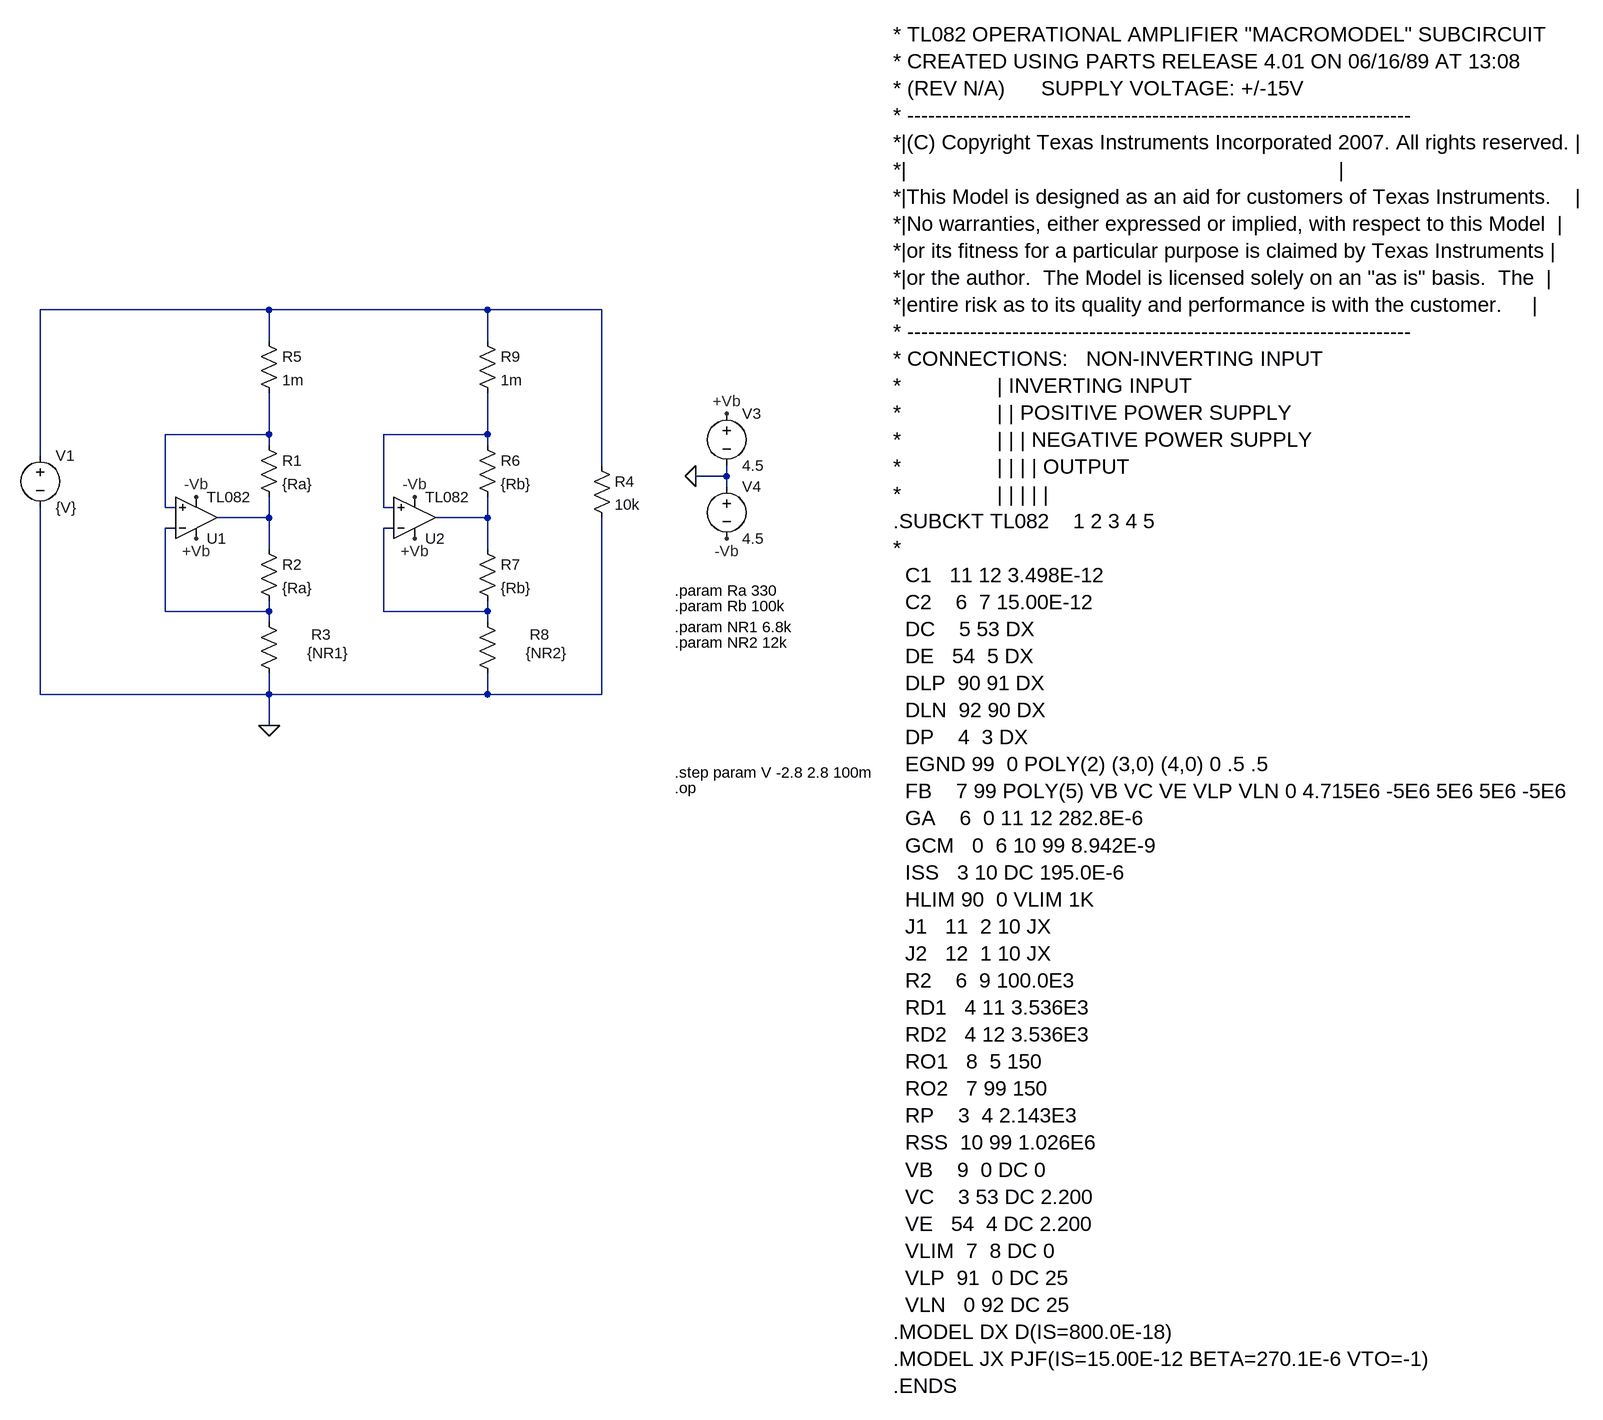
[diagram p0: schematic negres.asc]
negres.asc, the LTspice schematic file:
Version 4
SHEET 1 1280 2032
WIRE -1504 -368 -1856 -368
WIRE -1168 -368 -1504 -368
WIRE -992 -368 -1168 -368
WIRE -1504 -320 -1504 -368
WIRE -1168 -320 -1168 -368
WIRE -1504 -176 -1504 -240
WIRE -1504 -176 -1664 -176
WIRE -1168 -176 -1168 -240
WIRE -1168 -176 -1328 -176
WIRE -1504 -160 -1504 -176
WIRE -1168 -160 -1168 -176
WIRE -1856 -144 -1856 -368
WIRE -992 -128 -992 -368
WIRE -800 -112 -800 -128
WIRE -800 -112 -848 -112
WIRE -800 -96 -800 -112
WIRE -1664 -64 -1664 -176
WIRE -1648 -64 -1664 -64
WIRE -1328 -64 -1328 -176
WIRE -1312 -64 -1328 -64
WIRE -1504 -48 -1504 -80
WIRE -1504 -48 -1584 -48
WIRE -1168 -48 -1168 -80
WIRE -1168 -48 -1248 -48
WIRE -1648 -32 -1664 -32
WIRE -1312 -32 -1328 -32
WIRE -1504 0 -1504 -48
WIRE -1168 0 -1168 -48
WIRE -1664 96 -1664 -32
WIRE -1504 96 -1504 80
WIRE -1504 96 -1664 96
WIRE -1328 96 -1328 -32
WIRE -1168 96 -1168 80
WIRE -1168 96 -1328 96
WIRE -1504 112 -1504 96
WIRE -1168 112 -1168 96
WIRE -1856 224 -1856 -64
WIRE -1504 224 -1504 192
WIRE -1504 224 -1856 224
WIRE -1168 224 -1168 192
WIRE -1168 224 -1504 224
WIRE -992 224 -992 -48
WIRE -992 224 -1168 224
WIRE -1504 272 -1504 224
FLAG -800 -16 -Vb
FLAG -800 -208 +Vb
FLAG -848 -112 0
FLAG -1616 -80 -Vb
FLAG -1616 -16 +Vb
FLAG -1504 272 0
FLAG -1280 -80 -Vb
FLAG -1280 -16 +Vb
SYMBOL voltage -800 -224 R0
WINDOW 123 0 0 Left 2
WINDOW 39 24 124 Left 2
SYMATTR InstName V3
SYMATTR Value 4.5
SYMBOL voltage -800 -112 R0
WINDOW 123 0 0 Left 2
WINDOW 39 24 124 Left 2
SYMATTR InstName V4
SYMATTR Value 4.5
SYMBOL Opamps\\opamp2 -1616 16 M180
SYMATTR InstName U1
SYMATTR Value TL082
SYMBOL res -1520 -176 R0
SYMATTR InstName R1
SYMATTR Value {Ra}
SYMATTR SpiceLine tol=5 pwr=1
SYMBOL res -1520 -16 R0
SYMATTR InstName R2
SYMATTR Value {Ra}
SYMATTR SpiceLine tol=5 pwr=1
SYMBOL res -1520 96 R0
WINDOW 0 81 36 Left 2
WINDOW 3 75 64 Left 2
SYMATTR InstName R3
SYMATTR Value {NR1}
SYMATTR SpiceLine tol=5 pwr=1
SYMBOL voltage -1856 -160 R0
WINDOW 123 0 0 Left 2
WINDOW 39 24 124 Left 2
SYMATTR InstName V1
SYMATTR Value {V}
SYMBOL res -1008 -144 R0
SYMATTR InstName R4
SYMATTR Value 10k
SYMBOL res -1520 -336 R0
SYMATTR InstName R5
SYMATTR Value 1m
SYMBOL Opamps\\opamp2 -1280 16 M180
SYMATTR InstName U2
SYMATTR Value TL082
SYMBOL res -1184 -176 R0
SYMATTR InstName R6
SYMATTR Value {Rb}
SYMATTR SpiceLine tol=5 pwr=1
SYMBOL res -1184 -16 R0
SYMATTR InstName R7
SYMATTR Value {Rb}
SYMATTR SpiceLine tol=5 pwr=1
SYMBOL res -1184 96 R0
WINDOW 0 81 36 Left 2
WINDOW 3 75 64 Left 2
SYMATTR InstName R8
SYMATTR Value {NR2}
SYMATTR SpiceLine tol=5 pwr=1
SYMBOL res -1184 -336 R0
SYMATTR InstName R9
SYMATTR Value 1m
TEXT -544 -792 Left 3 !* TL082 OPERATIONAL AMPLIFIER "MACROMODEL" SUBCIRCUIT\n* CREATED USING PARTS RELEASE 4.01 ON 06/16/89 AT 13:08\n* (REV N/A)      SUPPLY VOLTAGE: +/-15V\n* ------------------------------------------------------------------------\n*|(C) Copyright Texas Instruments Incorporated 2007. All rights reserved. |\n*|                                                                        |\n*|This Model is designed as an aid for customers of Texas Instruments.    |\n*|No warranties, either expressed or implied, with respect to this Model  |\n*|or its fitness for a particular purpose is claimed by Texas Instruments |\n*|or the author.  The Model is licensed solely on an "as is" basis.  The  |\n*|entire risk as to its quality and performance is with the customer.     |\n* ------------------------------------------------------------------------\n* CONNECTIONS:   NON-INVERTING INPUT\n*                | INVERTING INPUT\n*                | | POSITIVE POWER SUPPLY\n*                | | | NEGATIVE POWER SUPPLY\n*                | | | | OUTPUT\n*                | | | | |\n.SUBCKT TL082    1 2 3 4 5\n*\n  C1   11 12 3.498E-12\n  C2    6  7 15.00E-12\n  DC    5 53 DX\n  DE   54  5 DX\n  DLP  90 91 DX\n  DLN  92 90 DX\n  DP    4  3 DX\n  EGND 99  0 POLY(2) (3,0) (4,0) 0 .5 .5\n  FB    7 99 POLY(5) VB VC VE VLP VLN 0 4.715E6 -5E6 5E6 5E6 -5E6\n  GA    6  0 11 12 282.8E-6\n  GCM   0  6 10 99 8.942E-9\n  ISS   3 10 DC 195.0E-6\n  HLIM 90  0 VLIM 1K\n  J1   11  2 10 JX\n  J2   12  1 10 JX\n  R2    6  9 100.0E3\n  RD1   4 11 3.536E3\n  RD2   4 12 3.536E3\n  RO1   8  5 150\n  RO2   7 99 150\n  RP    3  4 2.143E3\n  RSS  10 99 1.026E6\n  VB    9  0 DC 0\n  VC    3 53 DC 2.200\n  VE   54  4 DC 2.200\n  VLIM  7  8 DC 0\n  VLP  91  0 DC 25\n  VLN   0 92 DC 25\n.MODEL DX D(IS=800.0E-18)\n.MODEL JX PJF(IS=15.00E-12 BETA=270.1E-6 VTO=-1)\n.ENDS
TEXT -880 344 Left 2 !.step param V -2.8 2.8 100m
TEXT -880 368 Left 2 !.op
TEXT -880 64 Left 2 !.param Ra 330
TEXT -880 88 Left 2 !.param Rb 100k
TEXT -880 120 Left 2 !.param NR1 6.8k
TEXT -880 144 Left 2 !.param NR2 12k

The netlist it stands for:
* negres.asc
V3 +Vb 0 4.5
V4 0 -Vb 4.5
XU1 N002 N006 +Vb -Vb N004 TL082  ; pins In+ In- V+ V- OUT
R1 N002 N004 {Ra} tol=5 pwr=1
R2 N004 N006 {Ra} tol=5 pwr=1
R3 N006 0 {NR1} tol=5 pwr=1
V1 N001 0 {V}
R4 N001 0 10k
R5 N001 N002 1m
XU2 N003 N007 +Vb -Vb N005 TL082  ; pins In+ In- V+ V- OUT
R6 N003 N005 {Rb} tol=5 pwr=1
R7 N005 N007 {Rb} tol=5 pwr=1
R8 N007 0 {NR2} tol=5 pwr=1
R9 N001 N003 1m
* TL082 OPERATIONAL AMPLIFIER "MACROMODEL" SUBCIRCUIT
* CREATED USING PARTS RELEASE 4.01 ON 06/16/89 AT 13:08
* (REV N/A)      SUPPLY VOLTAGE: +/-15V
* ------------------------------------------------------------------------
*|(C) Copyright Texas Instruments Incorporated 2007. All rights reserved. |
*|                                                                        |
*|This Model is designed as an aid for customers of Texas Instruments.    |
*|No warranties, either expressed or implied, with respect to this Model  |
*|or its fitness for a particular purpose is claimed by Texas Instruments |
*|or the author.  The Model is licensed solely on an "as is" basis.  The  |
*|entire risk as to its quality and performance is with the customer.     |
* ------------------------------------------------------------------------
* CONNECTIONS:   NON-INVERTING INPUT
*                | INVERTING INPUT
*                | | POSITIVE POWER SUPPLY
*                | | | NEGATIVE POWER SUPPLY
*                | | | | OUTPUT
*                | | | | |
.SUBCKT TL082    1 2 3 4 5
*
  C1   11 12 3.498E-12
  C2    6  7 15.00E-12
  DC    5 53 DX
  DE   54  5 DX
  DLP  90 91 DX
  DLN  92 90 DX
  DP    4  3 DX
  EGND 99  0 POLY(2) (3,0) (4,0) 0 .5 .5
  FB    7 99 POLY(5) VB VC VE VLP VLN 0 4.715E6 -5E6 5E6 5E6 -5E6
  GA    6  0 11 12 282.8E-6
  GCM   0  6 10 99 8.942E-9
  ISS   3 10 DC 195.0E-6
  HLIM 90  0 VLIM 1K
  J1   11  2 10 JX
  J2   12  1 10 JX
  R2    6  9 100.0E3
  RD1   4 11 3.536E3
  RD2   4 12 3.536E3
  RO1   8  5 150
  RO2   7 99 150
  RP    3  4 2.143E3
  RSS  10 99 1.026E6
  VB    9  0 DC 0
  VC    3 53 DC 2.200
  VE   54  4 DC 2.200
  VLIM  7  8 DC 0
  VLP  91  0 DC 25
  VLN   0 92 DC 25
.MODEL DX D(IS=800.0E-18)
.MODEL JX PJF(IS=15.00E-12 BETA=270.1E-6 VTO=-1)
.ENDS
.step param V -2.8 2.8 100m
.op
.param Ra 330
.param Rb 100k
.param NR1 6.8k
.param NR2 12k
.backanno
.end